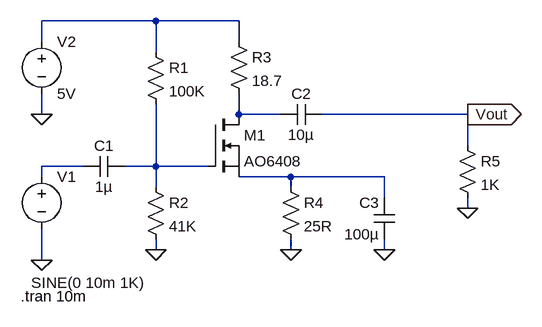
[diagram p0: schematic NNM24EE060_KruthikaS.asc]
NNM24EE060_KruthikaS.asc, the LTspice schematic file:
Version 4
SHEET 1 880 680
WIRE 112 0 -64 0
WIRE 240 0 112 0
WIRE -64 32 -64 0
WIRE 240 32 240 0
WIRE 112 48 112 0
WIRE -64 144 -64 112
WIRE 240 144 240 112
WIRE 304 144 240 144
WIRE 592 144 368 144
WIRE 592 192 592 144
WIRE 0 224 -64 224
WIRE 112 224 112 128
WIRE 112 224 64 224
WIRE 192 224 112 224
WIRE -64 240 -64 224
WIRE 320 240 240 240
WIRE 464 240 320 240
WIRE 112 256 112 224
WIRE 320 256 320 240
WIRE 464 272 464 240
WIRE 592 288 592 272
WIRE 112 352 112 336
WIRE 320 352 320 336
WIRE 464 352 464 336
WIRE -64 368 -64 320
FLAG -64 144 0
FLAG -64 368 0
FLAG 112 352 0
FLAG 320 352 0
FLAG 464 352 0
FLAG 592 288 0
FLAG 592 144 Vout
IOPIN 592 144 Out
SYMBOL res 96 240 R0
SYMATTR InstName R2
SYMATTR Value 41K
SYMBOL res 304 240 R0
SYMATTR InstName R4
SYMATTR Value 25R
SYMBOL res 576 176 R0
SYMATTR InstName R5
SYMATTR Value 1K
SYMBOL nmos 192 144 R0
SYMATTR InstName M1
SYMATTR Value AO6408
SYMBOL voltage -64 224 R0
WINDOW 3 -16 179 Left 2
WINDOW 123 0 0 Left 0
WINDOW 39 0 0 Left 0
SYMATTR Value SINE(0 10m 1K)
SYMATTR InstName V1
SYMBOL voltage -64 16 R0
WINDOW 123 0 0 Left 0
WINDOW 39 0 0 Left 0
SYMATTR InstName V2
SYMATTR Value 5V
SYMBOL cap 64 208 R90
WINDOW 0 0 32 VBottom 2
WINDOW 3 32 32 VTop 2
SYMATTR InstName C1
SYMATTR Value 1µ
SYMBOL cap 368 128 R90
WINDOW 0 0 32 VBottom 2
WINDOW 3 32 32 VTop 2
SYMATTR InstName C2
SYMATTR Value 10µ
SYMBOL cap 480 336 R180
WINDOW 0 24 56 Left 2
WINDOW 3 24 8 Left 2
SYMATTR InstName C3
SYMATTR Value 100µ
SYMBOL res 96 32 R0
SYMATTR InstName R1
SYMATTR Value 100K
SYMBOL res 224 16 R0
SYMATTR InstName R3
SYMATTR Value 18.7
TEXT -96 424 Left 2 !.tran 10m

The netlist it stands for:
* NNM24EE060_KruthikaS.asc
R2 N004 0 41K
R4 N005 0 25R
R5 Vout 0 1K
M1 N002 N004 N005 N005 AO6408
V1 N003 0 SINE(0 10m 1K)
V2 N001 0 5V
C1 N004 N003 1µ
C2 Vout N002 10µ
C3 0 N005 100µ
R1 N001 N004 100K
R3 N001 N002 18.7
.model NMOS NMOS
.model PMOS PMOS
.lib standard.mos
.tran 10m
.backanno
.end